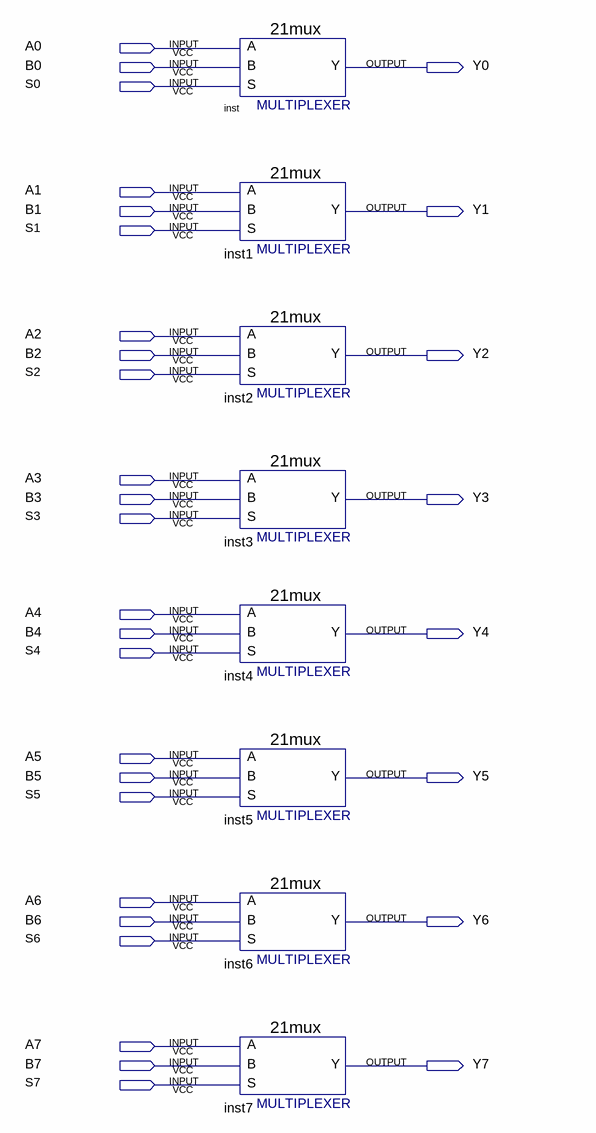
[diagram p0: schematic sheet]
// Quartus schematic 8_bit_mux.bdf as structural Verilog: 8 symbols, 32 pins
module \8_bit_mux  (
  input  A0,
  input  B0,
  input  S0,
  input  A1,
  input  B1,
  input  S1,
  input  A2,
  input  B2,
  input  S2,
  input  A3,
  input  B3,
  input  S3,
  input  A4,
  input  B4,
  input  S4,
  input  A5,
  input  B5,
  input  S5,
  input  A6,
  input  B6,
  input  S6,
  input  A7,
  input  B7,
  input  S7,
  output Y0,
  output Y1,
  output Y2,
  output Y3,
  output Y4,
  output Y5,
  output Y6,
  output Y7
);

  \21mux  inst (.S(S0), .B(B0), .A(A0), .Y(Y0));
  \21mux  inst1 (.S(S1), .B(B1), .A(A1), .Y(Y1));
  \21mux  inst2 (.S(S2), .B(B2), .A(A2), .Y(Y2));
  \21mux  inst3 (.S(S3), .B(B3), .A(A3), .Y(Y3));
  \21mux  inst4 (.S(S4), .B(B4), .A(A4), .Y(Y4));
  \21mux  inst5 (.S(S5), .B(B5), .A(A5), .Y(Y5));
  \21mux  inst6 (.S(S6), .B(B6), .A(A6), .Y(Y6));
  \21mux  inst7 (.S(S7), .B(B7), .A(A7), .Y(Y7));
endmodule
